# EAGLE design subtractor-amp03_p-stm_v1.0 (EAGLE 6.5.0)
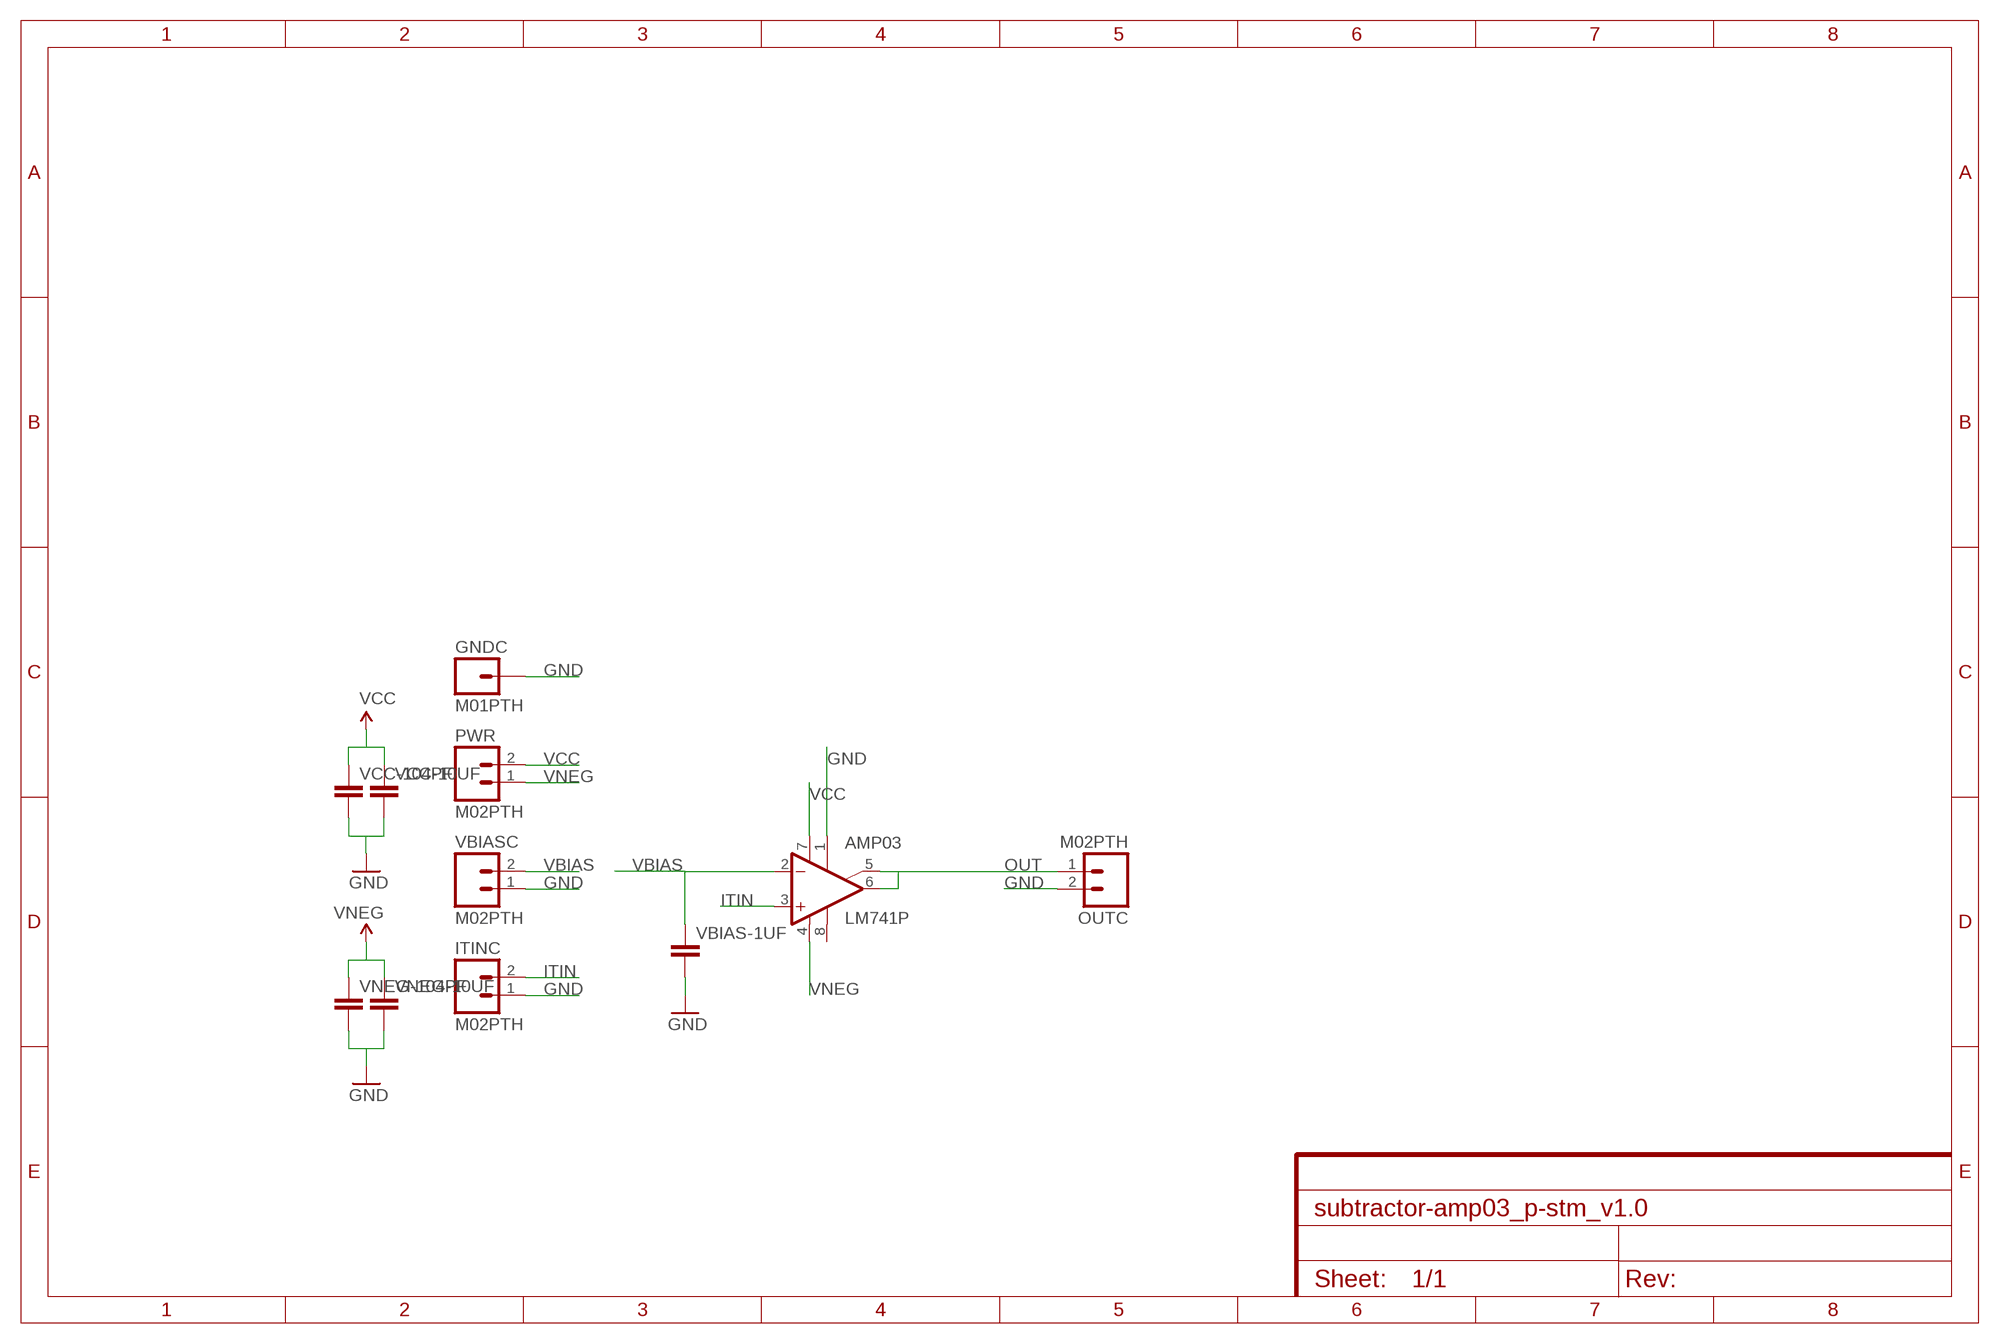
[diagram p0: schematic, sheet 1]

## Parts
AMP03  LM741P  [DIL08]
GNDC  M01PTH  [1X01]
ITINC  M02PTH  [1X02]
OUTC  M02PTH  [1X02]
PWR  M02PTH  [1X02]
VBIAS-1UF  CAPPTH2  [CAP-PTH-SMALL2]
VBIASC  M02PTH  [1X02]
VCC-10UF  CAPPTH2  [CAP-PTH-SMALL2]
VCC-104PF  CAPPTH2  [CAP-PTH-SMALL2]
VNEG-10UF  CAPPTH2  [CAP-PTH-SMALL2]
VNEG-104PF  CAPPTH2  [CAP-PTH-SMALL2]

## Nets
GND: AMP03.1(ON1) GNDC.1 ITINC.1 OUTC.2 VBIAS-1UF.2 VBIASC.1 VCC-10UF.2 VCC-104PF.2 VNEG-10UF.2 VNEG-104PF.2
ITIN: AMP03.3(-IN) ITINC.2
OUT: AMP03.5(ON2) AMP03.6(OUT) OUTC.1
VBIAS: AMP03.2(+IN) VBIAS-1UF.1 VBIASC.2
VCC: AMP03.7(V+) PWR.2 VCC-10UF.1 VCC-104PF.1
VNEG: AMP03.4(V-) PWR.1 VNEG-10UF.1 VNEG-104PF.1
Unconnected: AMP03.8(OPT)

## Library data of the parts
AMP03 = linear:*741: OP AMP
GNDC = SparkFun-Connectors:M01: Header 1 Standard 1-pin 0.1" header. Use with straight break away headers (SKU : PRT-00116), right angle break away headers (PRT-00553), swiss pins (PRT-00743), machine pins (PRT-00117), and female headers (PRT-00115).
ITINC OUTC PWR VBIASC = SparkFun-Connectors:M02: Standard 2-pin 0.1" header. Use with - straight break away headers ( PRT-00116) - right angle break away headers (PRT-00553) - swiss pins (PRT-00743) - machine pins (PRT-00117) - female headers (PRT-00115) Molex polarized connector foot print use with: PRT-08233 with associated crimp pins and housings. 2.54_SCREWTERM for use with PRT-10571. 3.5mm Screw Terminal footprints for PRT-08084 5mm Screw Terminal footprints for use with PRT-08432
VBIAS-1UF VCC-10UF VCC-104PF VNEG-10UF VNEG-104PF = SparkFun-Capacitors:CAP: Capacitor Standard 0603 ceramic capacitor, and 0.1" leaded capacitor.

## Board
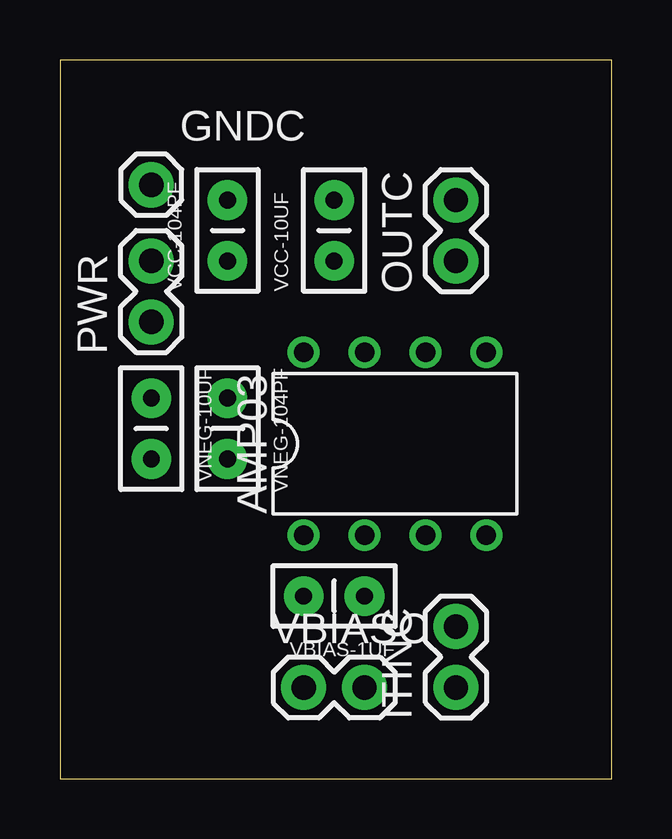
[diagram p1: board, top side]
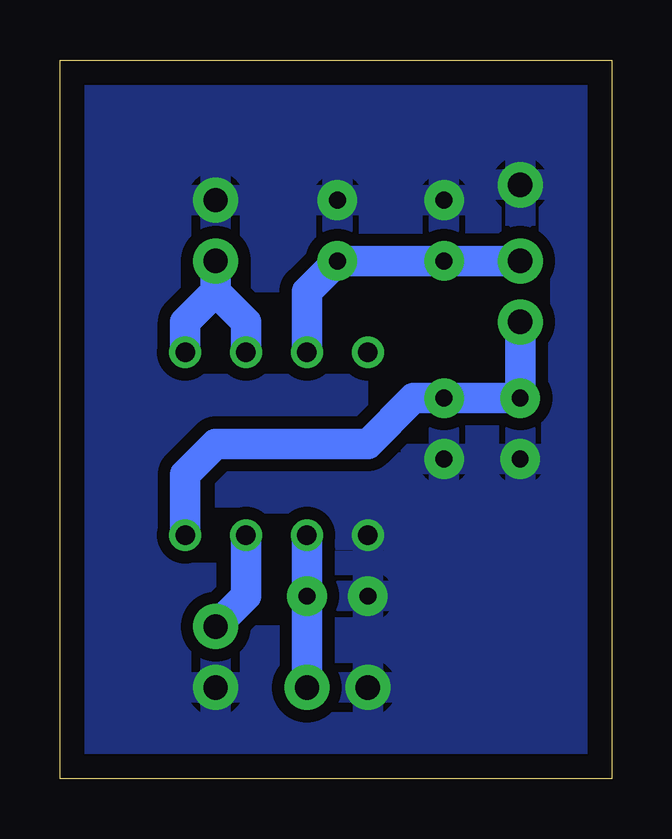
[diagram p2: board, bottom side, seen from below]

Size 23 x 29.97 mm. Coordinates in mm from the lower left corner, seen from the top.
Outline: 0,0 23,0 23,29.97 0,29.97 0,0
Copper layers (1*16): Top 0.035mm / dielectric 1.5mm / Bottom 0.035mm
Design rules "default": minimum track width 10mil, minimum drill 24mil, track to track 8mil, track to pad 8mil, pad to pad 8mil, via to via 8mil, smd to smd 8mil, copper to edge 40mil, drill to drill 8mil, minimum pad ring 10mil, minimum via ring 8mil, stop-mask expansion 4mil, vias tented up to drill 0mil, thermal gap 10mil

### Footprints (pad centres in the part's own frame; a part is rotated, then mirrored left to right if it is on the bottom)
DIL08 = drill 0.813 pad 1.27: 1 -3.81,-3.81; 2 -1.27,-3.81; 3 1.27,-3.81; 4 3.81,-3.81; 5 3.81,3.81; 6 1.27,3.81; 7 -1.27,3.81; 8 -3.81,3.81
1X01 = drill 1.016 pad 1.88: 1 0,0
1X02 = drill 1.016 pad 1.88: 1 0,0; 2 2.54,0
CAP-PTH-SMALL2 = drill 0.7 pad 1.651: 1 0,0; 2 2.54,0

### Placement (x,y rotation side)
AMP03  13.97,13.97 0 top
GNDC  3.81,24.77 0 top
ITINC  16.51,3.81 90 top
OUTC  16.51,21.59 90 top
PWR  3.81,19.05 90 top
VBIAS-1UF  12.7,7.62 180 top
VBIASC  10.16,3.81 0 top
VCC-10UF  11.43,21.59 90 top
VCC-104PF  6.99,21.59 90 top
VNEG-10UF  3.81,15.88 270 top
VNEG-104PF  6.99,15.88 270 top

### Tracks (layer width: path | path; a pad name or v marks a point on that pad's centre or on a via)
GND
  pour Bottom (isolate 0.508): 0,30.48 0,0 22.86,0 22.86,29.21 22.86,30.48
ITIN
  Bottom 1.27: ITINC.2 15.24,7.62 AMP03.3
OUT
  Bottom 1.27: OUTC.1 16.51,20.32 | 16.51,20.32 15.24,19.05 AMP03.6 | AMP03.5 17.78,19.05 16.51,20.32
VBIAS
  Bottom 1.27: AMP03.2 VBIAS-1UF.1 VBIASC.2
VCC
  Bottom 1.27: AMP03.7 12.7,20.32 VCC-10UF.1 VCC-104PF.1 PWR.2
VNEG
  Bottom 1.27: PWR.1 VNEG-10UF.1 VNEG-104PF.1 8.26,15.88 10.16,13.97 16.51,13.97 17.78,12.7 AMP03.4